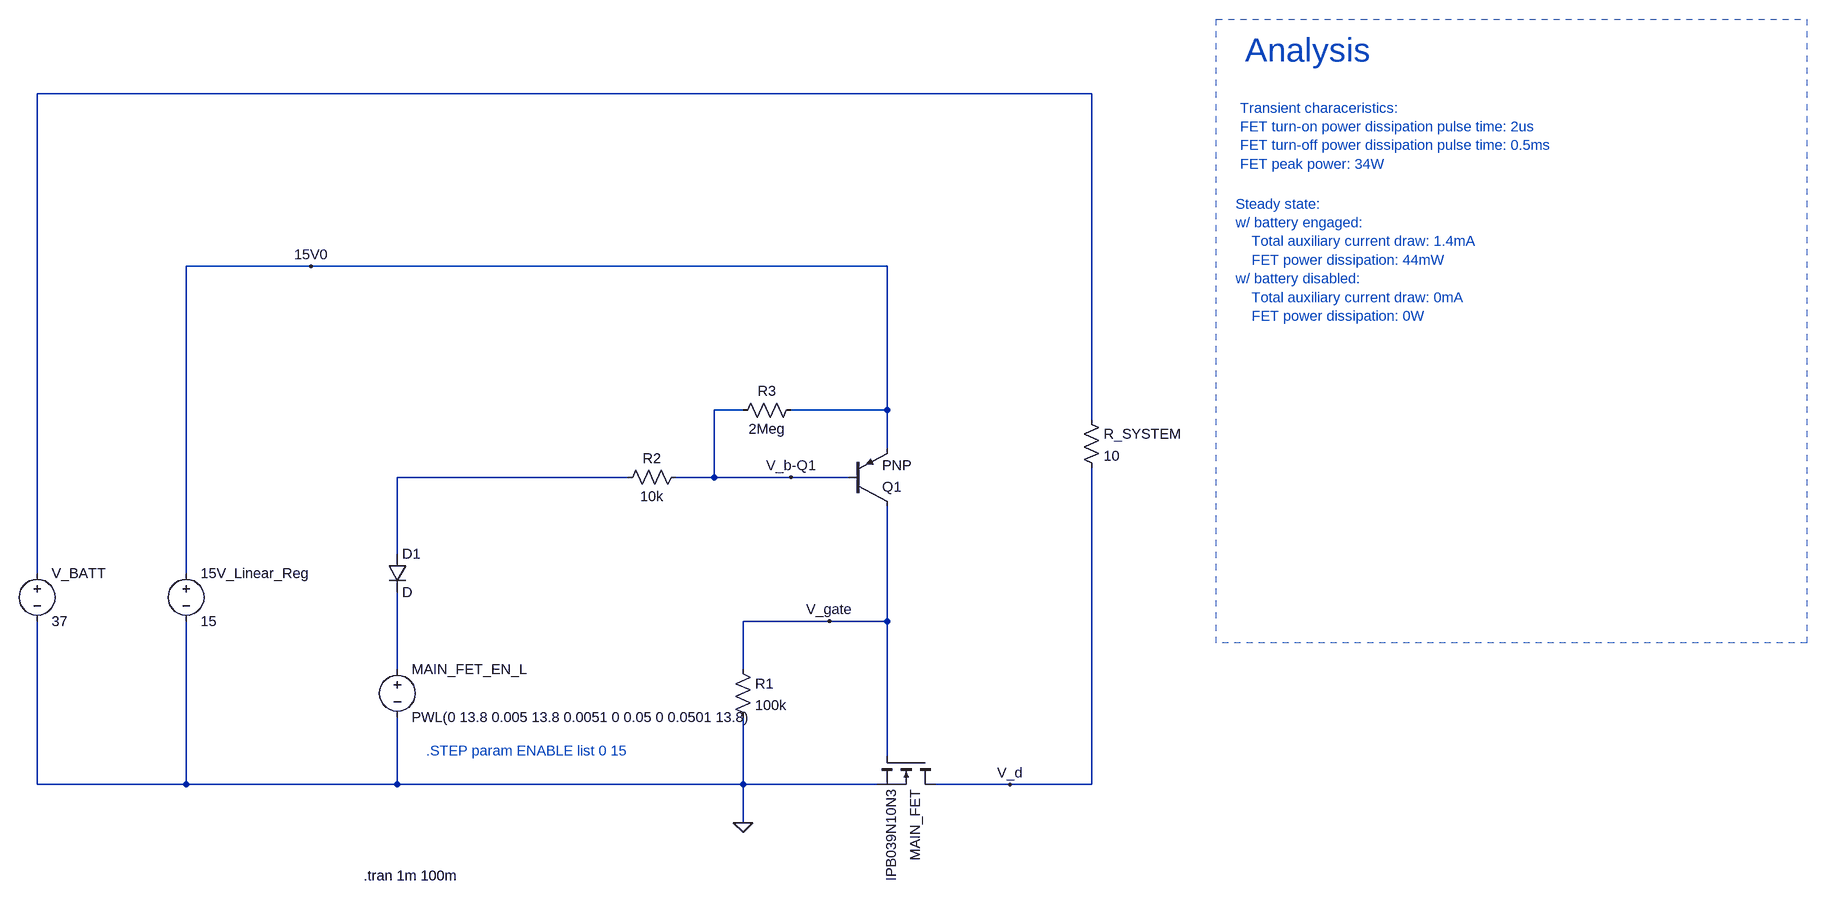
[diagram p0: schematic Main FET.asc]
Main FET.asc, the LTspice schematic file:
Version 4
SHEET 1 5144 2508
WIRE 2368 -208 224 -208
WIRE 912 80 704 80
WIRE 1872 80 912 80
WIRE 1632 320 1584 320
WIRE 1872 320 1872 80
WIRE 1872 320 1712 320
WIRE 2368 336 2368 -208
WIRE 1872 384 1872 320
WIRE 1440 432 1056 432
WIRE 1584 432 1584 320
WIRE 1584 432 1520 432
WIRE 1712 432 1584 432
WIRE 1808 432 1712 432
WIRE 1056 560 1056 432
WIRE 224 592 224 -208
WIRE 704 592 704 80
WIRE 1776 672 1632 672
WIRE 1872 672 1872 480
WIRE 1872 672 1776 672
WIRE 1056 752 1056 624
WIRE 1632 752 1632 672
WIRE 1872 896 1872 672
WIRE 224 944 224 672
WIRE 704 944 704 672
WIRE 704 944 224 944
WIRE 1056 944 1056 832
WIRE 1056 944 704 944
WIRE 1632 944 1632 832
WIRE 1632 944 1056 944
WIRE 1856 944 1632 944
WIRE 2112 944 1952 944
WIRE 2368 944 2368 416
WIRE 2368 944 2112 944
WIRE 1632 1008 1632 944
FLAG 1632 1008 0
FLAG 912 80 15V0
FLAG 1776 672 V_gate
FLAG 1712 432 V_b-Q1
FLAG 2112 944 V_d
SYMBOL pnp 1808 480 M180
SYMATTR InstName Q1
SYMBOL res 1536 416 R90
WINDOW 0 0 56 VBottom 2
WINDOW 3 32 56 VTop 2
SYMATTR InstName R2
SYMATTR Value 10k
SYMBOL res 1728 304 R90
WINDOW 0 0 56 VBottom 2
WINDOW 3 32 56 VTop 2
SYMATTR InstName R3
SYMATTR Value 2Meg
SYMBOL res 1616 736 R0
SYMATTR InstName R1
SYMATTR Value 100k
SYMBOL voltage 1056 736 R0
SYMATTR InstName MAIN_FET_EN_L
SYMATTR Value PWL(0 13.8 0.005 13.8 0.0051 0 0.05 0 0.0501 13.8)
SYMBOL voltage 704 576 R0
SYMATTR InstName 15V_Linear_Reg
SYMATTR Value 15
SYMBOL voltage 224 576 R0
SYMATTR InstName V_BATT
SYMATTR Value 37
SYMBOL res 2352 320 R0
SYMATTR InstName R_SYSTEM
SYMATTR Value 10
SYMBOL diode 1040 560 R0
SYMATTR InstName D1
SYMBOL nmos 1952 896 R90
SYMATTR InstName MAIN_FET
SYMATTR Value IPB039N10N3
TEXT 1000 1096 Left 2 !.tran 1m 100m
TEXT 2616 -184 Left 2 ;Transient characeristics:\nFET turn-on power dissipation pulse time: 2us\nFET turn-off power dissipation pulse time: 0.5ms\nFET peak power: 34W
TEXT 2624 -280 Left 5 ;Analysis
TEXT 2608 -24 Left 2 ;Steady state:\nw/ battery engaged:\n	Total auxiliary current draw: 1.4mA\n	FET power dissipation: 44mW\nw/ battery disabled:\n	Total auxiliary current draw: 0mA\n	FET power dissipation: 0W
TEXT 1104 888 Left 2 ;.STEP param ENABLE list 0 15
RECTANGLE Normal 2576 -332 3560 708 2

The netlist it stands for:
* Main FET.asc
Q1 V_gate V_b-Q1 15V0 0 PNP
R2 V_b-Q1 N002 10k
R3 15V0 V_b-Q1 2Meg
R1 V_gate 0 100k
V§MAIN_FET_EN_L N003 0 PWL(0 13.8 0.005 13.8 0.0051 0 0.05 0 0.0501 13.8)
V§15V_Linear_Reg 15V0 0 15
V_BATT N001 0 37
R_SYSTEM N001 V_d 10
D1 N002 N003 D
MAIN_FET V_d V_gate 0 0 IPB039N10N3
.model D D
.lib standard.dio
.model NPN NPN
.model PNP PNP
.lib standard.bjt
.model NMOS NMOS
.model PMOS PMOS
.lib standard.mos
.tran 1m 100m
* Transient characeristics:
* FET turn-on power dissipation pulse time: 2us
* FET turn-off power dissipation pulse time: 0.5ms
* FET peak power: 34W
* Analysis
* Steady state:
* w/ battery engaged:
* 	Total auxiliary current draw: 1.4mA
* 	FET power dissipation: 44mW
* w/ battery disabled:
* 	Total auxiliary current draw: 0mA
* 	FET power dissipation: 0W
* .STEP param ENABLE list 0 15
.backanno
.end